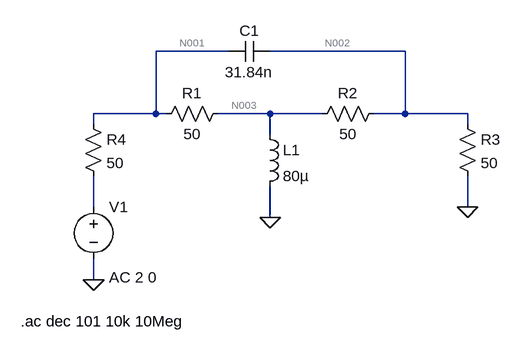
[diagram p0: schematic Zobal Network.asc]
Zobal Network.asc, the LTspice schematic file:
Version 4
SHEET 1 880 680
WIRE 144 -224 32 -224
WIRE 416 -224 208 -224
WIRE 32 -128 32 -224
WIRE 32 -128 -64 -128
WIRE 48 -128 32 -128
WIRE 208 -128 128 -128
WIRE 288 -128 208 -128
WIRE 416 -128 416 -224
WIRE 416 -128 368 -128
WIRE 512 -128 416 -128
WIRE -64 -112 -64 -128
WIRE 512 -112 512 -128
WIRE 208 -96 208 -128
WIRE -64 16 -64 -32
WIRE 512 16 512 -32
WIRE 208 32 208 -16
WIRE -64 128 -64 96
FLAG 208 32 0
FLAG 512 16 0
FLAG -64 128 0
SYMBOL res 32 -112 R270
WINDOW 0 32 56 VTop 2
WINDOW 3 0 56 VBottom 2
SYMATTR InstName R1
SYMATTR Value 50
SYMBOL ind 192 -112 R0
SYMATTR InstName L1
SYMATTR Value 80µ
SYMBOL res 384 -144 R90
WINDOW 0 0 56 VBottom 2
WINDOW 3 32 56 VTop 2
SYMATTR InstName R2
SYMATTR Value 50
SYMBOL cap 208 -240 R90
WINDOW 0 0 32 VBottom 2
WINDOW 3 32 32 VTop 2
SYMATTR InstName C1
SYMATTR Value 31.84n
SYMBOL res 496 -128 R0
SYMATTR InstName R3
SYMATTR Value 50
SYMBOL res -80 -128 R0
SYMATTR InstName R4
SYMATTR Value 50
SYMBOL voltage -64 0 R0
WINDOW 123 24 124 Left 2
WINDOW 39 0 0 Left 0
SYMATTR Value2 AC 2 0
SYMATTR InstName V1
SYMATTR Value ""
TEXT -176 192 Left 2 !.ac dec 101 10k 10Meg

The netlist it stands for:
* Zobal Network.asc
R1 N001 N003 50
L1 N003 0 80µ
R2 N002 N003 50
C1 N002 N001 31.84n
R3 N002 0 50
R4 N001 N004 50
V1 N004 0 AC 2 0
.ac dec 101 10k 10Meg
.backanno
.end

* Results of the author's LTspice run, read from the files saved beside the schematic
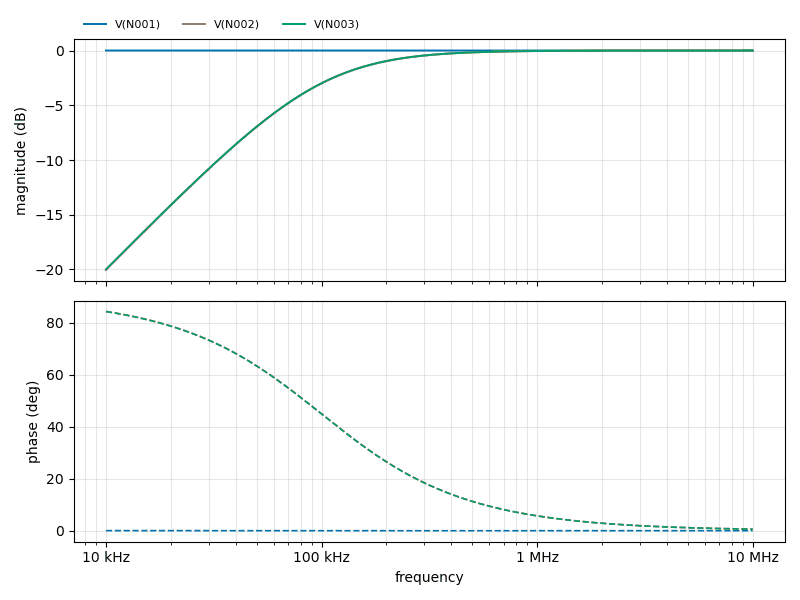
[diagram p1: AC Analysis of Zobal Network.asc, plotted from the saved traces]
* AC Analysis, 1 run:
*   V(N001): 0.00 dB at 10 kHz, 0.00 dB at 10 MHz, peak 0.01 dB at 100 kHz
*   V(N002): -20.02 dB at 10 kHz, -0.00 dB at 10 MHz, peak -0.00 dB at 10 MHz, 3 dB below the peak at 99.72 kHz
*   V(N003): -20.00 dB at 10 kHz, -0.00 dB at 10 MHz, peak -0.00 dB at 10 MHz, 3 dB below the peak at 99.47 kHz